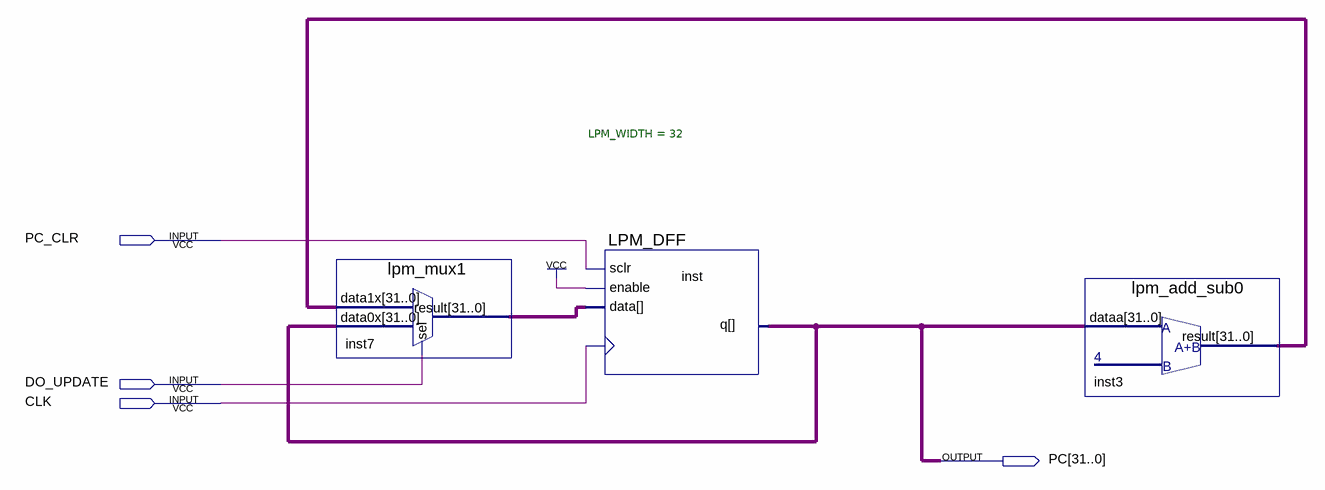
[diagram p0: schematic sheet]
// Quartus schematic PC.bdf as structural Verilog: 3 symbols, 4 pins
module PC (
  input  PC_CLR,
  input  DO_UPDATE,
  input  CLK,
  output [31:0] PC
);

  wire [31:0] inst3_result, inst7_result;

  lpm_mux1 inst7 (.data1x(inst3_result), .data0x(PC), .sel(DO_UPDATE), .result(inst7_result));
  LPM_DFF #(.LPM_WIDTH(32)) inst (.enable(1'b1), .clock(CLK), .data(inst7_result), .sclr(PC_CLR), .q(PC));
  lpm_add_sub0 inst3 (.dataa(PC), .result(inst3_result));
endmodule
